# EAGLE design guest room controller V2 (EAGLE 9.6.2)
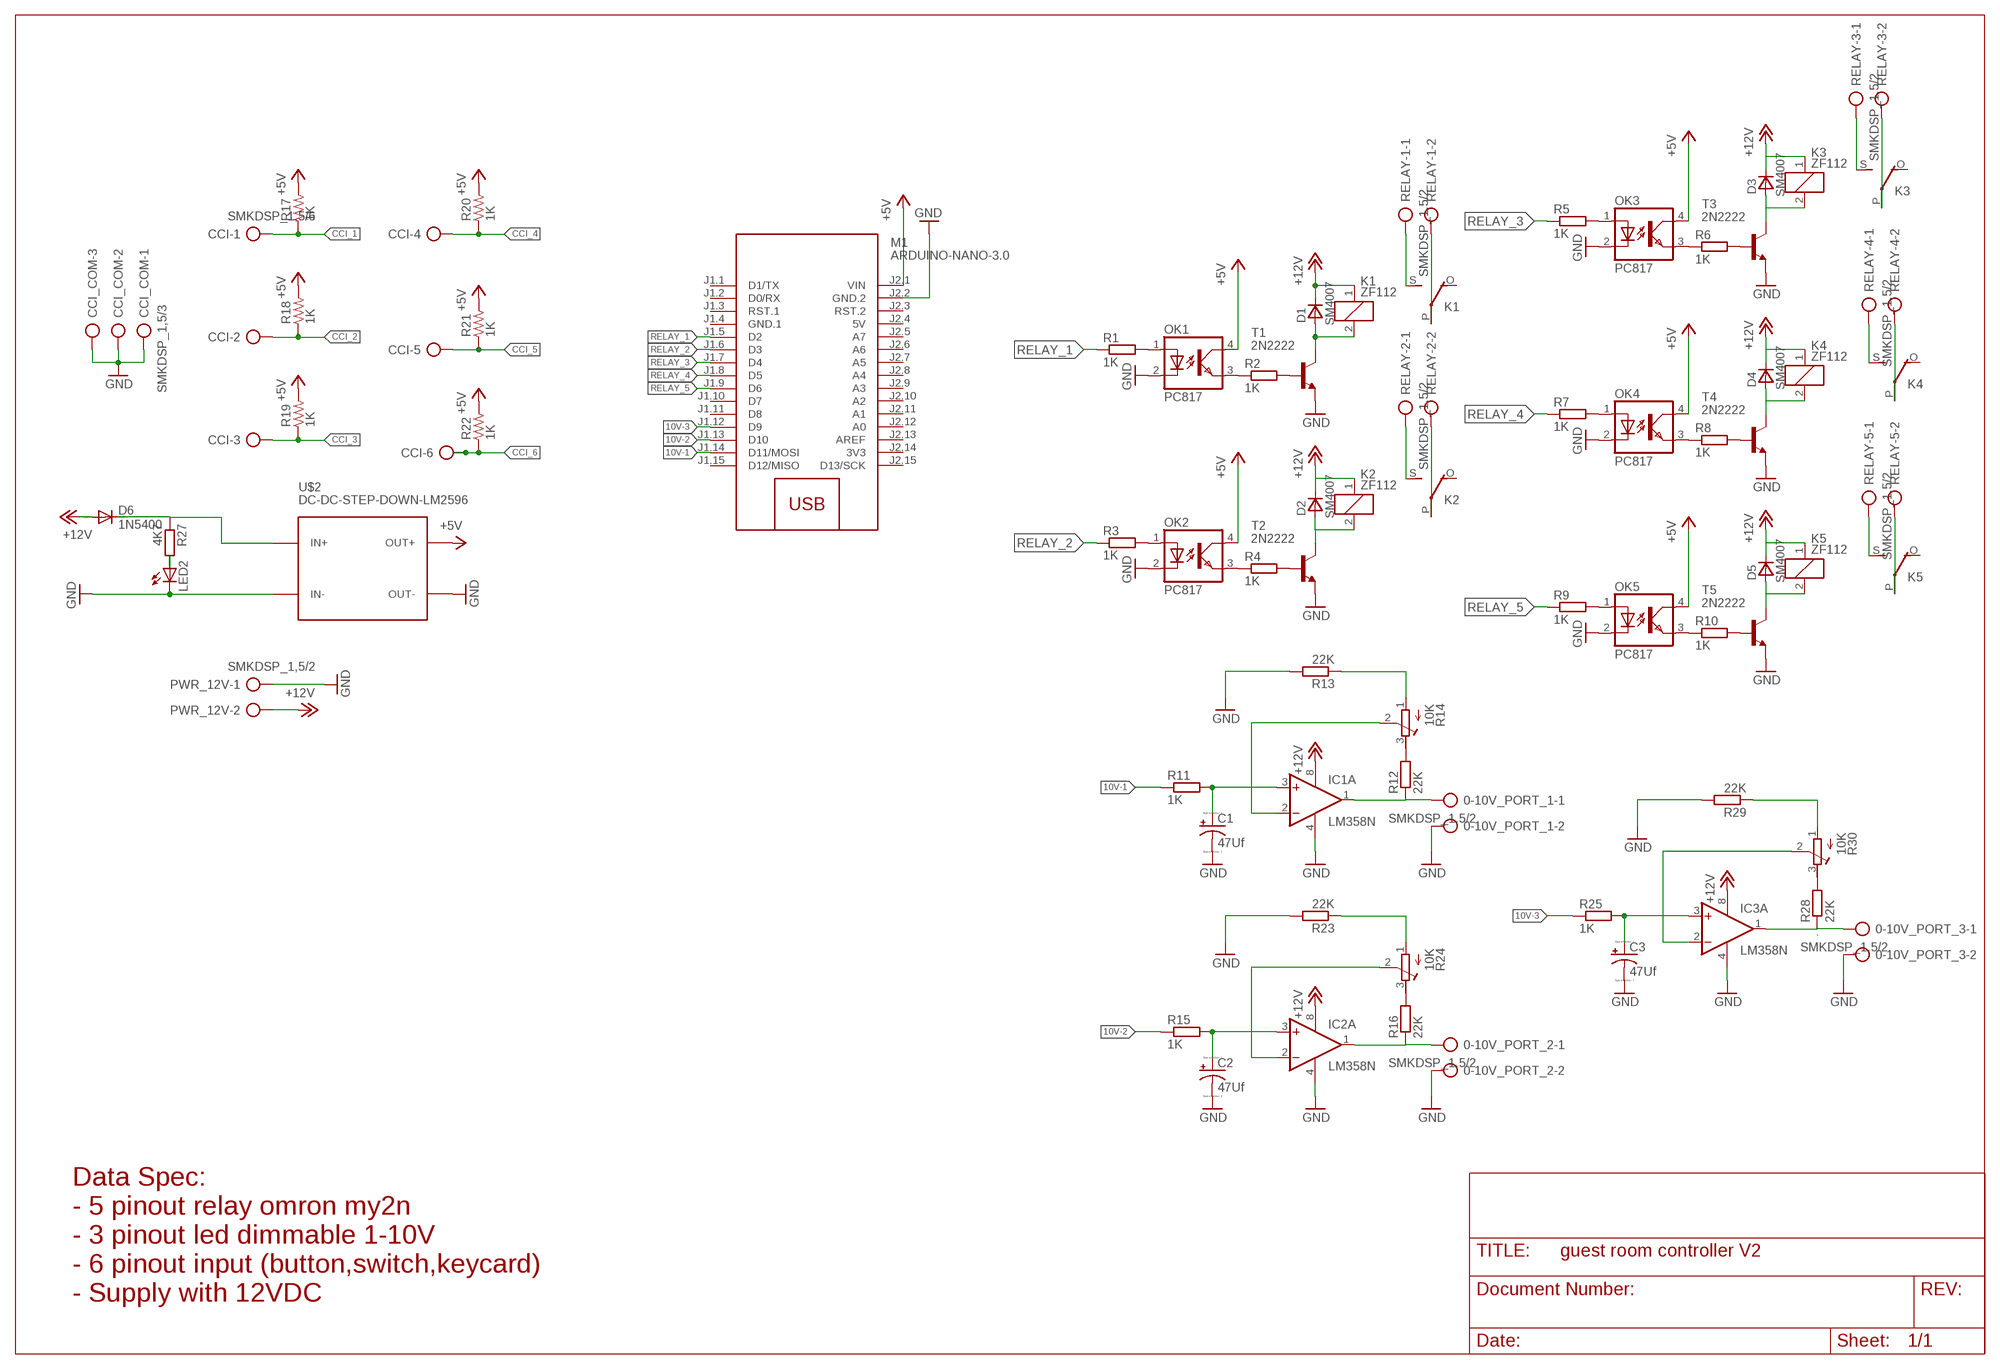
[diagram p0: schematic, sheet 1]

## Parts
0-10V_PORT_1  SMKDSP_1,5/2  [SMKDSP_1,5/2]
0-10V_PORT_2  SMKDSP_1,5/2  [SMKDSP_1,5/2]
0-10V_PORT_3  SMKDSP_1,5/2  [SMKDSP_1,5/2]
C1  47Uf  CPOL-USE2.5-6  [E2,5-6]
C2  47Uf  CPOL-USE2.5-6  [E2,5-6]
C3  47Uf  CPOL-USE2.5-6  [E2,5-6]
CCI  SMKDSP_1,5/6  [SMKDSP_1,5/6]
CCI_COM  SMKDSP_1,5/3  [SMKDSP_1,5/3]
D1  SM4007  [MELF-MLL41]
D2  SM4007  [MELF-MLL41]
D3  SM4007  [MELF-MLL41]
D4  SM4007  [MELF-MLL41]
D5  SM4007  [MELF-MLL41]
D6  1N5400  [DO201-15]
IC1  LM358N  [DIL08]
IC2  LM358N  [DIL08]
IC3  LM358N  [DIL08]
K1  ZF112  [ZF112]
K2  ZF112  [ZF112]
K3  ZF112  [ZF112]
K4  ZF112  [ZF112]
K5  ZF112  [ZF112]
LED2  LED3MM  [LED3MM]
M1  ARDUINO-NANO-3.0  [ARDUINO-NANO-3.0]
OK1  PC817  [DIL04]
OK2  PC817  [DIL04]
OK3  PC817  [DIL04]
OK4  PC817  [DIL04]
OK5  PC817  [DIL04]
PWR_12V  SMKDSP_1,5/2  [SMKDSP_1,5/2]
R1  1K  R-EU_0207/10  [0207/10]
R2  1K  R-EU_0207/10  [0207/10]
R3  1K  R-EU_0207/10  [0207/10]
R4  1K  R-EU_0207/10  [0207/10]
R5  1K  R-EU_0207/10  [0207/10]
R6  1K  R-EU_0207/10  [0207/10]
R7  1K  R-EU_0207/10  [0207/10]
R8  1K  R-EU_0207/10  [0207/10]
R9  1K  R-EU_0207/10  [0207/10]
R10  1K  R-EU_0207/10  [0207/10]
R11  1K  R-EU_0207/10  [0207/10]
R12  22K  R-EU_0207/10  [0207/10]
R13  22K  R-EU_0207/10  [0207/10]
R14  10K  R-TRIMM64P  [RTRIM64P]
R15  1K  R-EU_0207/10  [0207/10]
R16  22K  R-EU_0207/10  [0207/10]
R17  1K  R_1206  [R1206]
R18  1K  R_1206  [R1206]
R19  1K  R_1206  [R1206]
R20  1K  R_1206  [R1206]
R21  1K  R_1206  [R1206]
R22  1K  R_1206  [R1206]
R23  22K  R-EU_0207/10  [0207/10]
R24  10K  R-TRIMM64P  [RTRIM64P]
R25  1K  R-EU_0207/10  [0207/10]
R27  4K7  R-EU_0207/10  [0207/10]
R28  22K  R-EU_0207/10  [0207/10]
R29  22K  R-EU_0207/10  [0207/10]
R30  10K  R-TRIMM64P  [RTRIM64P]
RELAY-1  SMKDSP_1,5/2  [SMKDSP_1,5/2]
RELAY-2  SMKDSP_1,5/2  [SMKDSP_1,5/2]
RELAY-3  SMKDSP_1,5/2  [SMKDSP_1,5/2]
RELAY-4  SMKDSP_1,5/2  [SMKDSP_1,5/2]
RELAY-5  SMKDSP_1,5/2  [SMKDSP_1,5/2]
T1  2N2222  [TO18]
T2  2N2222  [TO18]
T3  2N2222  [TO18]
T4  2N2222  [TO18]
T5  2N2222  [TO18]
U$2  DC-DC-STEP-DOWN-LM2596  [DC-DC-STEP-DOWN-LM2596]

## Nets
10V-1: M1.J1.14(D11/MOSI) R11.1
10V-2: M1.J1.13(D10) R15.1
10V-3: M1.J1.12(D9) R25.1
+5V: M1.J2.1(VIN) OK1.4(COL) OK2.4(COL) OK3.4(COL) OK4.4(COL) OK5.4(COL) R17.2 R18.2 R19.2 R20.2 R21.2 R22.2 U$2.OUT+
+12V: D1.C D2.C D3.C D4.C D5.C D6.A IC1.8(P:V+) IC2.8(P:V+) IC3.8(P:V+) K1.1 K2.1 K3.1 K4.1 K5.1 PWR_12V.2
CCI_1: CCI.1 R17.1
CCI_2: CCI.2 R18.1
CCI_3: CCI.3 R19.1
CCI_4: CCI.4 R20.1
CCI_5: CCI.5 R21.1
CCI_6: CCI.6 R22.1
GND: 0-10V_PORT_1.2 0-10V_PORT_2.2 0-10V_PORT_3.2 C1.- C2.- C3.- CCI_COM.1 CCI_COM.2 CCI_COM.3 IC1.4(P:V-) IC2.4(P:V-) IC3.4(P:V-) LED2.K(C) M1.J2.2(GND.2) OK1.2(C) OK2.2(C) OK3.2(C) OK4.2(C) OK5.2(C) PWR_12V.1 R13.2 R23.2 R29.2 T1.1(E) T2.1(E) T3.1(E) T4.1(E) T5.1(E) U$2.IN- U$2.OUT-
N$1: OK1.3(EMIT) R2.1
N$2: R2.2 T1.2(B)
N$3: D1.A K1.2 T1.3(C)
N$4: OK2.3(EMIT) R4.1
N$5: R4.2 T2.2(B)
N$6: D2.A K2.2 T2.3(C)
N$7: OK3.3(EMIT) R6.1
N$8: R6.2 T3.2(B)
N$9: D3.A K3.2 T3.3(C)
N$10: OK4.3(EMIT) R8.1
N$11: R8.2 T4.2(B)
N$12: D4.A K4.2 T4.3(C)
N$13: OK5.3(EMIT) R10.1
N$14: R10.2 T5.2(B)
N$15: D5.A K5.2 T5.3(C)
N$16: K1.S(2:S) RELAY-1.1
N$17: LED2.A R27.2
N$18: C1.+ IC1.3(A:+IN) R11.2
N$19: 0-10V_PORT_1.1 IC1.1(A:OUT) R12.1
N$20: R12.2 R14.3(E)
N$21: IC1.2(A:-IN) R14.2(S)
N$22: R13.1 R14.1(A)
N$25: C2.+ IC2.3(A:+IN) R15.2
N$26: OK1.1(A) R1.2
N$27: OK2.1(A) R3.2
N$28: OK3.1(A) R5.2
N$29: OK4.1(A) R7.2
N$30: OK5.1(A) R9.2
N$31: 0-10V_PORT_2.1 IC2.1(A:OUT) R16.1
N$32: D6.C R27.1 U$2.IN+
N$34: K1.P(2:P) RELAY-1.2
N$35: R16.2 R24.3(E)
N$36: K2.S(2:S) RELAY-2.1
N$37: IC2.2(A:-IN) R24.2(S)
N$38: R23.1 R24.1(A)
N$40: C3.+ IC3.3(A:+IN) R25.2
N$41: 0-10V_PORT_3.1 IC3.1(A:OUT) R28.1
N$42: R28.2 R30.3(E)
N$43: IC3.2(A:-IN) R30.2(S)
N$44: R29.1 R30.1(A)
N$45: K2.P(2:P) RELAY-2.2
N$46: K3.S(2:S) RELAY-3.1
N$47: K3.P(2:P) RELAY-3.2
N$48: K4.P(2:P) RELAY-4.2
N$49: K4.S(2:S) RELAY-4.1
N$50: K5.P(2:P) RELAY-5.2
N$51: K5.S(2:S) RELAY-5.1
RELAY_1: M1.J1.5(D2) R1.1
RELAY_2: M1.J1.6(D3) R3.1
RELAY_3: M1.J1.7(D4) R5.1
RELAY_4: M1.J1.8(D5) R7.1
RELAY_5: M1.J1.9(D6) R9.1
Unconnected: IC1.5(B:+IN) IC1.6(B:-IN) IC1.7(B:OUT) IC2.5(B:+IN) IC2.6(B:-IN) IC2.7(B:OUT) IC3.5(B:+IN) IC3.6(B:-IN) IC3.7(B:OUT) K1.O(2:O) K2.O(2:O) K3.O(2:O) K4.O(2:O) K5.O(2:O) M1.J1.1(D1/TX) M1.J1.2(D0/RX) M1.J1.3(RST.1) M1.J1.10(D7) M1.J1.11(D8) M1.J1.15(D12/MISO) M1.J2.3(RST.2) M1.J2.5(A7) M1.J2.6(A6) M1.J2.7(A5) M1.J2.8(A4) M1.J2.9(A3) M1.J2.10(A2) M1.J2.11(A1) M1.J2.12(A0) M1.J2.13(AREF) M1.J2.15(D13/SCK)

## Notes on the sheet
- Data Spec:
  - 5 pinout relay omron my2n
  - 3 pinout led dimmable 1-10V
  - 6 pinout input (button,switch,keycard)
  - Supply with 12VDC

## Power pins joined to a net without a drawn wire
3V3: M1.J2.14(3V3)
5V: M1.J2.4(5V)
GND.1: M1.J1.4(GND.1)

## Library data of the parts
0-10V_PORT_1-0-10V_PORT_3 PWR_12V RELAY-1-RELAY-5 = con-phoenix-smkdsp:SMKDSP_1,5/2: Printklemme, Nennstrom: 17,5 A, Bemessungsspannung: 250 V, Raster: 5,0 mm Source: http://eshop.phoenixcontact.de .. 1733415.pdf; MF: FARNELL; MPN: 1733570; OC_FARNELL: 3041244; OC_NEWARK: 69C8588
C1-C3 = resistor:CPOL-US: POLARIZED CAPACITOR, American symbol
CCI = con-phoenix-smkdsp:SMKDSP_1,5/6: Printklemme, Nennstrom: 17,5 A, Bemessungsspannung: 250 V, Raster: 5,0 mm Source: http://eshop.phoenixcontact.de .. 1733415.pdf; MF: FARNELL; MPN: 1733619; OC_FARNELL: 3041270; OC_NEWARK: 71C4132
CCI_COM = con-phoenix-smkdsp:SMKDSP_1,5/3: Printklemme, Nennstrom: 17,5 A, Bemessungsspannung: 250 V, Raster: 5,0 mm Source: http://eshop.phoenixcontact.de .. 1733415.pdf; MF: FARNELL; MPN: 1733583; OC_FARNELL: 3041256; OC_NEWARK: 71C4130
D1-D5 = _mod_diode:SM400*: SM4001 .. SM4007 General Purpose Rectifier, 1 A SMD-Version of 1N4001 .. 1N4007 Case: MELF-MLL41 = DO 213 AB Author: Dipl.-Ing. FH Rainer Bayer HHN Hochschule Heilbronn, rainer.bayer@hs-heilbronn.de Ingenieurbüro ing-rb, mail@ing-rb.de
D6 = diode:1N5400: DIODE standard rectifier, 3 A, 50 V (Motorola)
IC1-IC3 = linear:LM358: OP AMP also LM158; LM258; LM2904 Source: http://cache.national.com/ds/LM/LM158.pdf
K1-K5 = relay:ZF112: RELAY 1 x switch; OC_FARNELL: unknown; OC_NEWARK: unknown
LED2 = led:LED: LED OSRAM: - CHIPLED LG R971, LG N971, LY N971, LG Q971, LY Q971, LO R971, LY R971 LH N974, LH R974 LS Q976, LO Q976, LY Q976 LO Q996 - Hyper CHIPLED LW Q18S LB Q993, LB Q99A, LB R99A - SideLED LS A670, LO A670, LY A670, LG A670, LP A670 LB A673, LV A673, LT A673, LW A673 LH A674 LY A675 LS A676, LA A676, LO A676, LY A676, LW A676 LS A679, LY A679, LG A679 - Hyper Micro SIDELED® LS Y876, LA Y876, LO Y876, LY Y876 LT Y87S - SmartLED LW L88C, LW L88S LB L89C, LB L89S, LG L890 LS L89K, LO L89K, LY L89K LS L896, LA L896, LO L896, LY L896 - TOPLED LS T670, LO T670, LY T670, LG T670, LP T670 LSG T670, LSP T670, LSY T670, LOP T670, LYG T670 LG T671, LOG T671, LSG T671 LB T673, LV T673, LT T673, LW T673 LH T674 LS T676, LA T676, LO T676, LY T676, LB T676, LH T676, LSB T676, LW T676 LB T67C, LV T67C, LT T67C, LS T67K, LO T67K, LY T67K, LW E67C LS E67B, LA E67B, LO E67B, LY E67B, LB E67C, LV E67C, LT E67C LW T67C LS T679, LY T679, LG T679 LS T770, LO T770, LY T770, LG T770, LP T770 LB T773, LV T773, LT T773, LW T773 LH T774 LS E675, LA E675, LY E675, LS T675 LS T776, LA T776, LO T776, LY T776, LB T776 LHGB T686 LT T68C, LB T68C - Hyper Mini TOPLED® LB M676 - Mini TOPLED Santana® LG M470 LS M47K, LO M47K, LY M47K Source: http://www.osram.convergy.de LUXEON: - LUMILED® LXK2-PW12-R00, LXK2-PW12-S00, LXK2-PW14-U00, LXK2-PW14-V00 LXK2-PM12-R00, LXK2-PM12-S00, LXK2-PM14-U00 LXK2-PE12-Q00, LXK2-PE12-R00, LXK2-PE12-S00, LXK2-PE14-T00, LXK2-PE14-U00 LXK2-PB12-K00, LXK2-PB12-L00, LXK2-PB12-M00, LXK2-PB14-N00, LXK2-PB14-P00, LXK2-PB14-Q00 LXK2-PR12-L00, LXK2-PR12-M00, LXK2-PR14-Q00, LXK2-PR14-R00 LXK2-PD12-Q00, LXK2-PD12-R00, LXK2-PD12-S00 LXK2-PH12-R00, LXK2-PH12-S00 LXK2-PL12-P00, LXK2-PL12-Q00, LXK2-PL12-R00 Source: www.luxeon.com KINGBRIGHT: KA-3528ASYC Source: www.kingbright.com
M1 = diy-modules:ARDUINO-NANO-3.0: Arduino Nano 3.0 and compatible devices More details available here: https://www.arduino.cc/en/Main/ArduinoBoardNano Click here to find device on ebay.com <http://www.ebay.com/sch/arduino+nano>
OK1-OK5 = optocoupler:PC817: SHARP OPTO COUPLER; MPN: PC817X4J000F; OC_FARNELL: 9707727; OC_NEWARK: 97K7059
R1-R13 R15 R16 R23 R25 R27-R29 = resistor:R-EU_: RESISTOR, European symbol
R14 R24 R30 = resistor:R-TRIMM: Trimm resistor
R17-R22 = rc-master-smd:R_: RESISTOR
T1-T5 = transistor:2N2222: NPN TRANSISTOR
U$2 = diy-modules:DC-DC-STEP-DOWN-LM2596: DC/DC Step-Down Regulator based on LM2596-ADJ chip LM2596 datasheet available here: http://www.ti.com/lit/ds/symlink/lm2596.pdf Click here to find device on ebay.com <http://www.ebay.com/sch/lm2596+power+regulator>

## Board
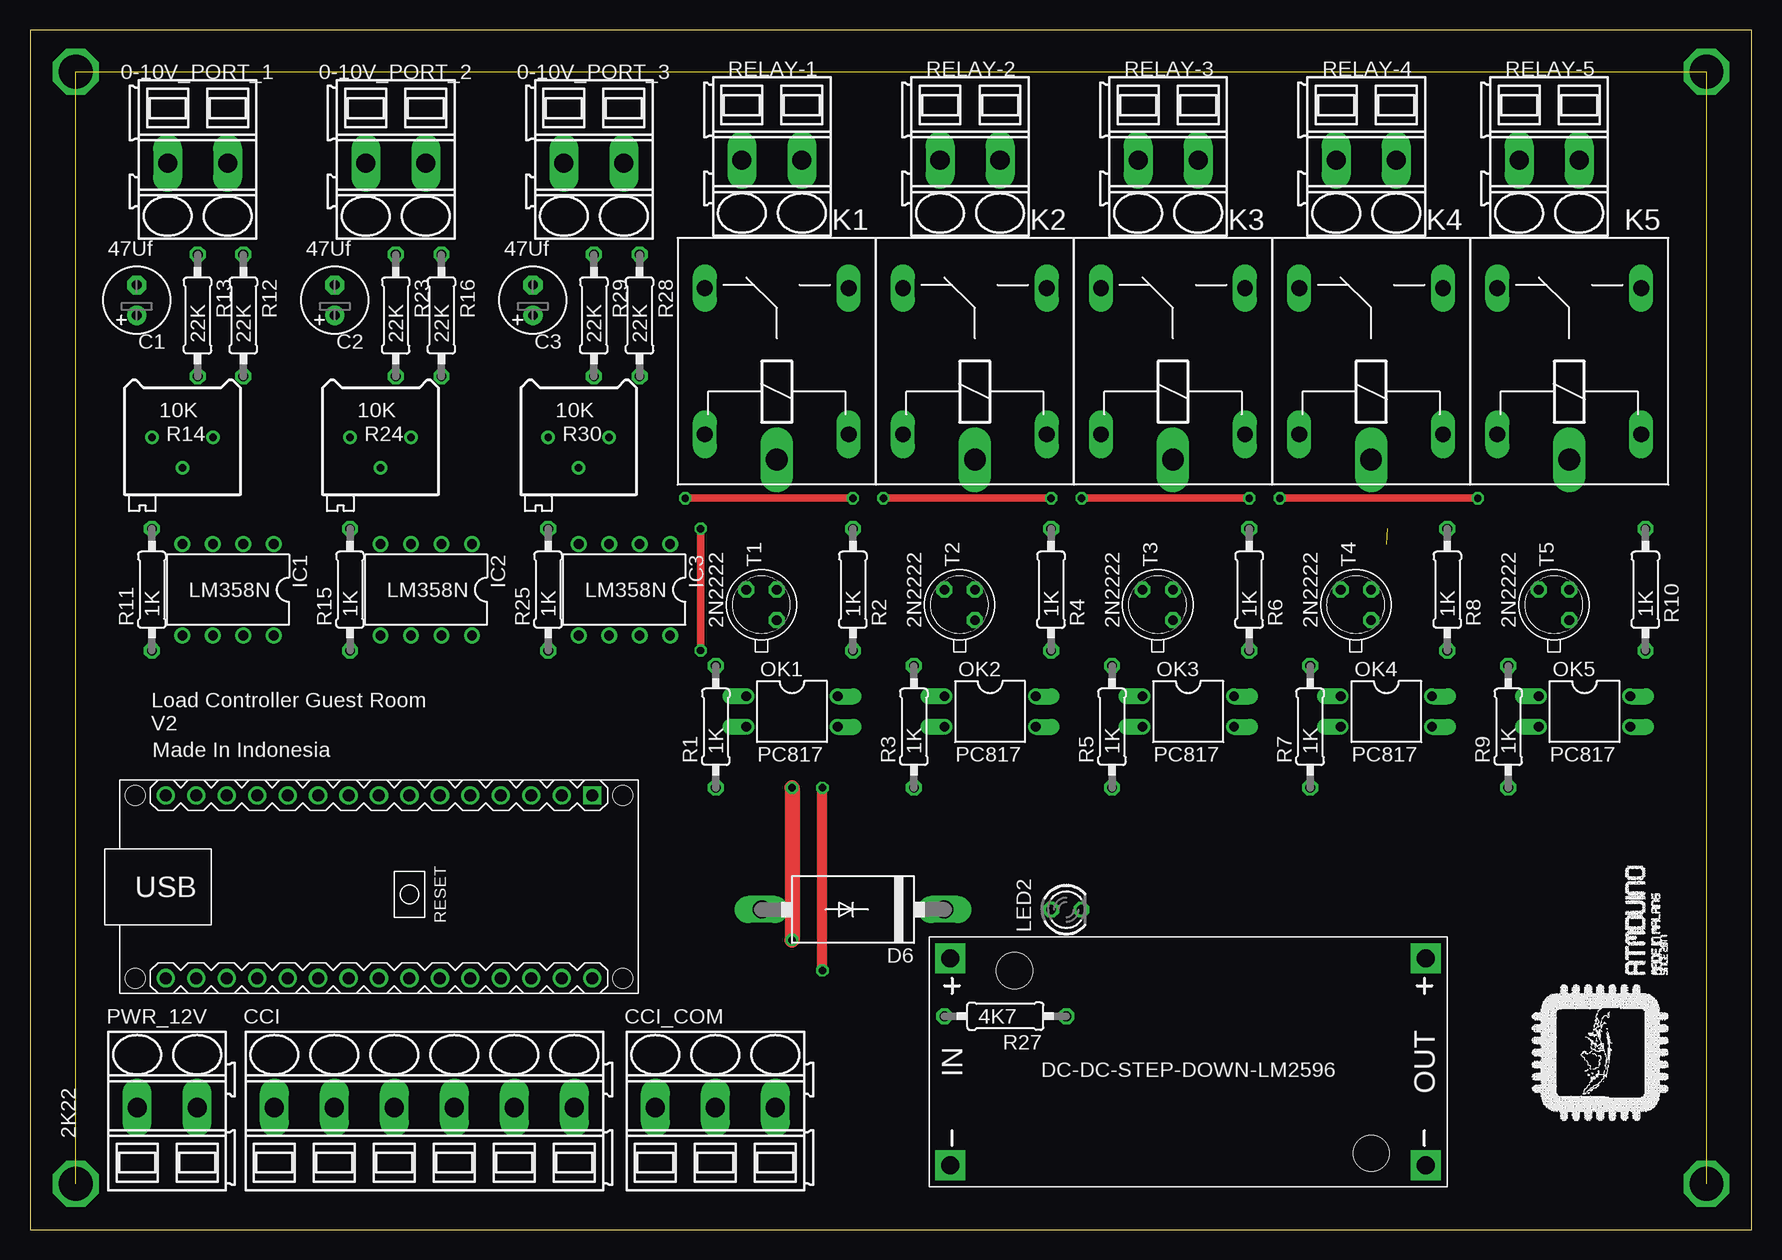
[diagram p1: board, top side]
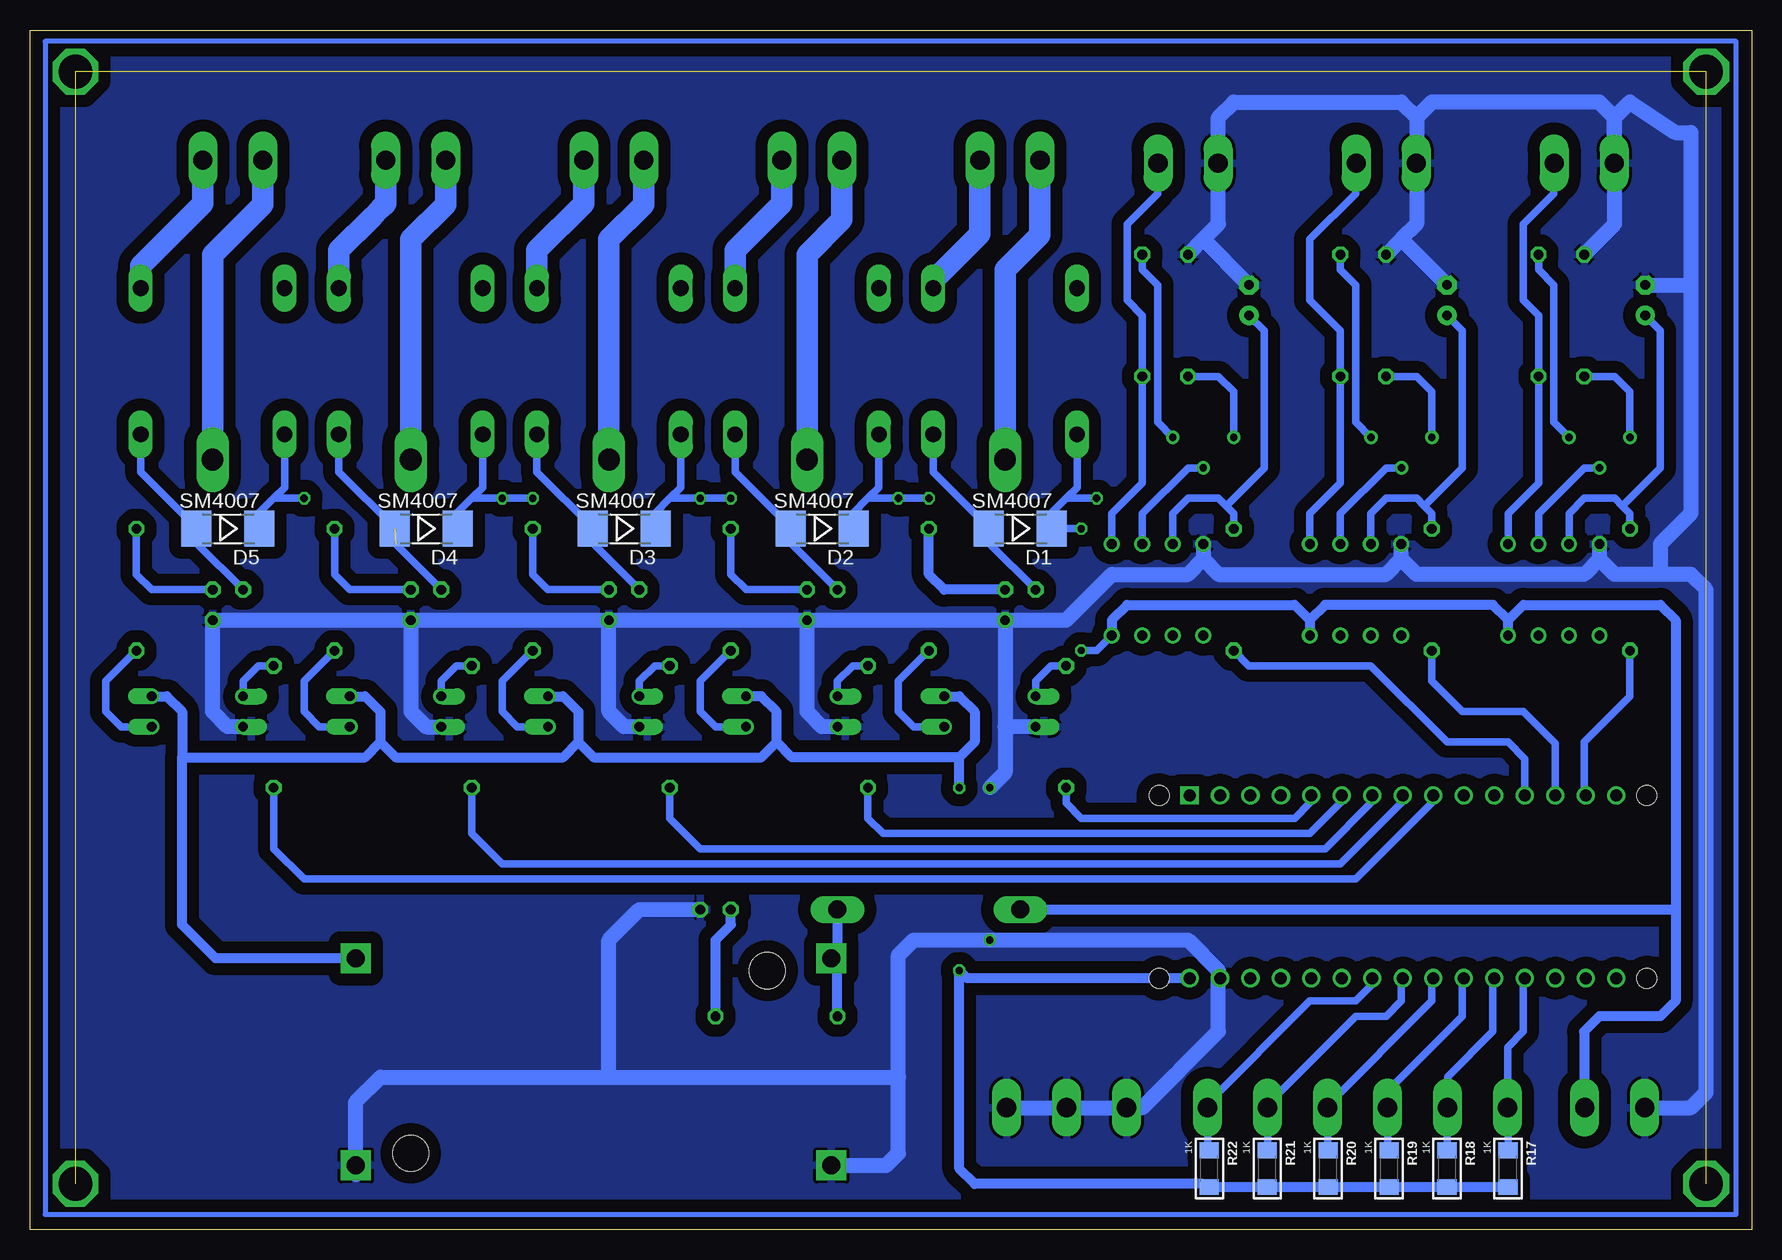
[diagram p2: board, bottom side, seen from below]

Size 143.49 x 100 mm. Coordinates in mm from the lower left corner, seen from the top.
Outline: 0,0 143.49,0 143.49,100 0,100 0,0
Copper layers (1*16): Top 0.035mm / dielectric 1.5mm / Bottom 0.035mm
Design rules "default": minimum track width 10mil, minimum drill 24mil, track to track 8mil, track to pad 8mil, pad to pad 8mil, via to via 8mil, smd to smd 8mil, copper to edge 40mil, drill to drill 8mil, minimum pad ring 10mil, minimum via ring 8mil, stop-mask expansion 4mil, vias tented up to drill 0mil, thermal gap 10mil

### Footprints (pad centres in the part's own frame; a part is rotated, then mirrored left to right if it is on the bottom)
SMKDSP_1,5/2 = drill 1.6 pad 1.8 long: 1 -2.5,0; 2 2.5,0
E2,5-6 = drill 0.813 pad 1.6: + -1.27,0 | drill 0.813 pad 1.6 octagon: - 1.27,0
SMKDSP_1,5/6 = drill 1.6 pad 1.8 long: 1 -2.5,0; 2 2.5,0; 3 7.5,0; 4 12.5,0; 5 17.5,0; 6 22.5,0
SMKDSP_1,5/3 = drill 1.6 pad 1.8 long: 1 -2.5,0; 2 2.5,0; 3 7.5,0
MELF-MLL41 = smd 2.5 x 3: A 2.625,0; C -2.625,0
DO201-15 = drill 1.499 long: A 7.62,0; C -7.62,0
DIL08 = drill 0.813 pad 1.27: 1 -3.81,-3.81; 2 -1.27,-3.81; 3 1.27,-3.81; 4 3.81,-3.81; 5 3.81,3.81; 6 1.27,3.81; 7 -1.27,3.81; 8 -3.81,3.81
ZF112 = drill 1.321 long: 1 -6.096,5.994; 2 -6.096,-5.994; O 6.096,5.994; S 6.096,-5.994 | drill 1.803 long: P -8.204,0
LED3MM = drill 0.813 octagon: A -1.27,0; K 1.27,0
ARDUINO-NANO-3.0 = drill 1 square: J1.1 17.78,7.62 | drill 1: J1.2 15.24,7.62; J1.3 12.7,7.62; J1.4 10.16,7.62; J1.5 7.62,7.62; J1.6 5.08,7.62; J1.7 2.54,7.62; J1.8 0,7.62; J1.9 -2.54,7.62; J1.10 -5.08,7.62; J1.11 -7.62,7.62; J1.12 -10.16,7.62; J1.13 -12.7,7.62; J1.14 -15.24,7.62; J1.15 -17.78,7.62; J2.1 17.78,-7.62; J2.2 15.24,-7.62; J2.3 12.7,-7.62; J2.4 10.16,-7.62; J2.5 7.62,-7.62; J2.6 5.08,-7.62; J2.7 2.54,-7.62; J2.8 0,-7.62; J2.9 -2.54,-7.62; J2.10 -5.08,-7.62; J2.11 -7.62,-7.62; J2.12 -10.16,-7.62; J2.13 -12.7,-7.62; J2.14 -15.24,-7.62; J2.15 -17.78,-7.62 | hole 1.651: -20.32,7.62; -20.32,-7.62; 20.32,-7.62; 20.32,7.62
DIL04 = drill 0.813 offset: 1 -1.27,-3.81; 2 1.27,-3.81; 3 1.27,3.81; 4 -1.27,3.81
0207/10 = drill 0.813 octagon: 1 -5.08,0; 2 5.08,0
RTRIM64P = drill 0.61: 1 0,-2.54; 2 2.54,0; 3 0,2.54
R1206 = smd 1.3 x 1.6: 1 -1.524,0; 2 1.524,0
TO18 = drill 0.813 octagon: 1 -1.27,-1.27; 2 1.27,-1.27; 3 1.27,1.27
DC-DC-STEP-DOWN-LM2596 = drill 1.5 pad 2.5 square: IN+ -19.812,8.636; IN- -19.812,-8.636; OUT+ 19.812,8.636; OUT- 19.812,-8.636 | hole 3: -14.478,7.62; 15.24,-7.62

### Placement (x,y rotation side)
0-10V_PORT_1  13.97,88.9 180 top
0-10V_PORT_2  30.48,88.9 180 top
0-10V_PORT_3  46.99,88.9 180 top
C1  8.89,77.47 90 top
C2  25.4,77.47 90 top
C3  41.91,77.47 90 top
CCI  22.86,10.16 0 top
CCI_COM  54.61,10.16 0 top
D1  60.96,58.42 180 bottom
D2  77.47,58.42 180 bottom
D3  93.98,58.42 180 bottom
D4  110.49,58.42 180 bottom
D5  127,58.42 180 bottom
D6  68.58,26.67 180 top
IC1  16.51,53.34 180 top
IC2  33.02,53.34 180 top
IC3  49.53,53.34 180 top
K1  62.23,72.39 90 top
K2  78.74,72.39 90 top
K3  95.25,72.39 90 top
K4  111.76,72.39 90 top
K5  128.27,72.39 90 top
LED2  86.36,26.67 0 top
M1  29.08,28.57 0 top
OK1  63.5,43.18 270 top
OK2  80.01,43.18 270 top
OK3  96.52,43.18 270 top
OK4  113.03,43.18 270 top
OK5  129.54,43.18 270 top
PWR_12V  11.43,10.16 0 top
R1  57.15,41.91 90 top
R2  68.58,53.34 90 top
R3  73.66,41.91 90 top
R4  85.09,53.34 90 top
R5  90.17,41.91 90 top
R6  101.6,53.34 90 top
R7  106.68,41.91 90 top
R8  118.11,53.34 90 top
R9  123.19,41.91 90 top
R10  134.62,53.34 90 top
R11  10.16,53.34 90 top
R12  17.78,76.2 90 top
R13  13.97,76.2 90 top
R14  12.7,66.04 270 top
R15  26.67,53.34 90 top
R16  34.29,76.2 90 top
R17  20.32,5.08 270 bottom
R18  25.4,5.08 270 bottom
R19  30.23,5.08 270 bottom
R20  35.31,5.08 270 bottom
R21  40.39,5.08 270 bottom
R22  45.21,5.08 270 bottom
R23  30.48,76.2 90 top
R24  29.21,66.04 270 top
R25  43.18,53.34 90 top
R27  81.28,17.78 0 top
R28  50.8,76.2 90 top
R29  46.99,76.2 90 top
R30  45.72,66.04 270 top
RELAY-1  61.82,89.15 180 top
RELAY-2  78.33,89.15 180 top
RELAY-3  94.84,89.15 180 top
RELAY-4  111.35,89.15 180 top
RELAY-5  126.59,89.15 180 top
T1  60.96,52.07 90 top
T2  77.47,52.07 90 top
T3  93.98,52.07 90 top
T4  110.49,52.07 90 top
T5  127,52.07 90 top
U$2  96.52,13.97 0 top

### Tracks (layer width: path | path; a pad name or v marks a point on that pad's centre or on a via)
10V-1
  Bottom 0.61: R11.1 10.16,44.45 13.97,40.64 13.97,36.32 M1.J1.14
10V-2
  Bottom 0.61: M1.J1.13 16.38,40.51 19.05,43.18 24.13,43.18 26.67,45.72 R15.1
10V-3
  Bottom 0.61: M1.J1.12 18.92,39.24 20.32,40.64 25.4,40.64 31.75,46.99 41.91,46.99 R25.1
+5V  (via drill 0.6)
  Top 0.813: v66.04,21.59 v66.04,36.83
  Bottom 0.61: R19.2 30.48,3.81 | R22.2 45.47,3.56 45.72,3.81
  Bottom 0.813: R22.2 R21.2 R20.2 R19.2 R18.2 R17.2 | OK1.4 66.04,44.45 64.77,43.18 64.77,40.64 66.04,39.37 | 66.04,39.37 80.01,39.37 81.28,40.64 | 81.28,40.64 81.28,43.18 82.55,44.45 OK2.4 | OK3.4 99.06,44.45 97.79,43.18 97.79,40.64 | 97.79,40.64 96.52,39.37 82.55,39.37 81.28,40.64 | OK4.4 115.57,44.45 114.3,43.18 114.3,40.64 | 114.3,40.64 113.03,39.37 99.06,39.37 97.79,40.64 | OK5.4 132.08,44.45 130.81,43.18 130.81,39.37 | 130.81,39.37 115.57,39.37 114.3,40.64 | U$2.OUT+ 128.02,22.61 130.81,25.4 130.81,39.37 | M1.J2.1 65.41,20.96 v66.04,21.59 66.04,5.08 64.77,3.81 45.72,3.81 | v66.04,36.83 66.04,39.37
+12V  (via drill 0.6)
  Top 0.61: v120.65,60.96 v104.14,60.96 | v101.6,60.96 v87.63,60.96 | v85.09,60.96 v71.12,60.96 | v68.58,60.96 v54.61,60.96 | v55.88,58.42 v55.88,48.26
  Bottom 0.61: K1.1 56.24,61.87 57.15,60.96 | 57.15,60.96 58.42,59.69 | 58.42,59.69 58.42,58.51 | 58.42,58.51 D1.C 58.33,59.6 58.42,59.69 | K4.1 105.77,61.87 106.68,60.96 | 106.68,60.96 107.95,59.69 107.95,58.51 D4.C | K2.1 72.75,61.87 73.66,60.96 | 73.66,60.96 74.93,59.69 74.93,58.51 D2.C | K5.1 122.28,61.87 123.19,60.96 | 124.37,59.77 124.46,59.69 124.46,58.42 D5.C 124.37,59.77 | K3.1 89.26,61.87 90.17,60.96 | 90.17,60.96 91.44,59.69 91.44,58.51 D3.C | 124.37,59.77 123.19,60.96 | 123.19,60.96 v120.65,60.96 | 106.68,60.96 v104.14,60.96 v101.6,60.96 | 90.17,60.96 v87.63,60.96 v85.09,60.96 | 73.66,60.96 v71.12,60.96 v68.58,60.96 | v54.61,60.96 57.15,60.96 | 58.42,58.51 58.42,58.42 v55.88,58.42 | v55.88,48.26 54.61,48.26 IC3.8
  Bottom 0.813: 20.32,50.8 21.59,52.07 35.56,52.07 36.83,50.8 | 36.83,50.8 IC2.8 | IC3.8 53.34,50.8 52.07,52.07 38.1,52.07 36.83,50.8 | PWR_12V.2 13.97,10.2 13.97,16.51 12.7,17.78 7.62,17.78 6.35,19.05 6.35,26.67 | IC1.8 20.32,50.8 | 20.32,50.8 19.05,52.07 7.62,52.07 6.35,50.8 6.35,26.67 | D6.A 6.35,26.67
CCI_1
  Bottom 0.61: R17.1 20.32,10.12 CCI.1 20.36,15.2 19.05,16.51 19.05,20.83
CCI_2
  Bottom 0.61: 21.59,20.83 21.59,16.51 25.36,12.74 CCI.2 25.4,10.12 R18.1
CCI_3
  Bottom 0.61: R19.1 30.36,6.74 CCI.3 30.36,11.55 24.13,17.78 24.13,20.83
CCI_4
  Bottom 0.61: R20.1 35.36,6.66 CCI.4 35.36,10.36 26.67,19.05 26.67,20.83
CCI_5
  Bottom 0.61: R21.1 40.36,6.63 CCI.5 40.36,10.44 33.02,17.78 30.48,17.78 29.21,19.05 29.21,20.83
CCI_6
  Bottom 0.61: R22.1 45.36,6.75 CCI.6 45.36,10.52 36.83,19.05 33.02,19.05 31.75,20.32 31.75,20.83
GND  (via drill 0.6)
  Top 1.27: v63.5,36.83 v63.5,24.13
  Bottom 1.27: T4.1 T5.1 128.27,43.18 127,41.91 OK5.2 | T4.1 T3.1 | T3.1 T2.1 | T2.1 T1.1 | OK3.2 93.98,41.91 95.25,43.18 T3.1 | OK2.2 77.47,41.91 78.74,43.18 T2.1 | CCI_COM.3 CCI_COM.1 | CCI_COM.1 52.07,10.16 | CCI_COM.1 50.8,10.16 44.45,16.51 44.45,20.83 M1.J2.2 44.45,21.08 44.45,21.59 46.99,24.13 v63.5,24.13 69.85,24.13 71.12,22.86 71.12,12.7 | T4.1 111.76,43.18 110.49,41.91 OK4.2 | v63.5,36.83 62.23,38.1 62.23,41.91 | 116.33,4.57 U$2.OUT- 116.33,10.67 114.3,12.7 95.25,12.7 | U$2.IN- 72.14,5.33 71.12,6.35 71.12,12.7 | 95.25,12.7 71.12,12.7 | 95.25,12.7 95.25,24.13 92.71,26.67 LED2.K | T1.1 62.23,41.91 | OK1.2 62.23,41.91 | 44.45,88.86 44.45,83.82 45.72,82.55 | 44.45,88.86 0-10V_PORT_3.2 | 27.94,92.71 26.67,93.98 12.7,93.98 11.47,92.75 0-10V_PORT_1.2 11.43,88.86 | 27.94,92.71 27.94,88.94 0-10V_PORT_2.2 27.94,88.86 27.94,83.82 29.21,82.55 | 44.45,88.86 44.45,92.71 43.18,93.98 29.21,93.98 27.94,92.71 | T1.1 57.15,50.8 53.34,54.61 46.99,54.61 45.72,55.88 | IC3.4 45.72,55.88 | 45.72,55.88 44.45,54.61 30.48,54.61 29.21,55.88 | 29.21,55.88 IC2.4 | IC1.4 12.7,55.88 | 12.7,55.88 13.97,54.61 27.94,54.61 29.21,55.88 | 5.08,78.74 5.08,59.69 7.62,57.15 7.62,54.61 | 7.62,54.61 11.43,54.61 12.7,55.88 | PWR_12V.1 5.08,10.16 3.81,11.43 3.81,53.34 5.08,54.61 7.62,54.61 | 11.43,88.86 11.43,92.71 10.16,93.98 6.35,91.44 5.08,91.44 5.08,78.74 | C1.- 5.08,78.74 | R13.2 11.43,83.82 11.43,88.86 | 29.21,82.55 R23.2 | R29.2 45.72,82.55 | C3.- 45.72,82.55 | C2.- 29.21,82.55
  pour Bottom (isolate 1.016): 2.54,97.79 140.97,97.79 140.97,2.54 2.54,2.54
N$1
  Bottom 0.61: R2.1 71.12,45.72 71.12,43.18 69.85,41.91 OK1.3
N$2
  Bottom 0.813: T1.2 67.31,53.34 68.58,54.61 R2.2
N$3
  Bottom 0.61: T1.3 63.58,57.24 D1.A 63.58,58.51 68.22,63.14 K1.2
N$4
  Bottom 0.61: R4.1 87.63,45.72 87.63,43.18 86.36,41.91 OK2.3
N$5
  Bottom 0.61: T2.2 83.82,53.34 85.09,54.61 R4.2
N$6
  Bottom 0.61: T2.3 80.01,57.15 80.01,58.34 D2.A 80.09,58.51 84.73,63.14 K2.2
N$7
  Bottom 0.61: R6.1 104.14,45.72 104.14,43.18 102.87,41.91 OK3.3
N$8
  Bottom 0.61: T3.2 100.33,53.34 101.6,54.61 R6.2
N$9
  Bottom 0.61: T3.3 96.52,57.15 96.52,58.42 D3.A 96.61,58.51 101.24,63.14 K3.2
N$10
  Bottom 0.61: R8.1 120.65,45.72 120.65,43.18 119.38,41.91 OK4.3
N$11
  Bottom 0.61: T4.2 116.84,53.34 118.11,54.61 R8.2
N$12  (1 unrouted)
  Bottom 0.61: T4.3 113.03,57.15 | D4.A 113.11,58.51 117.75,63.14 K4.2
N$13
  Bottom 0.61: R10.1 137.16,45.72 137.16,43.18 135.89,41.91 OK5.3
N$14
  Bottom 0.61: T5.2 133.35,53.34 134.62,54.61 R10.2
N$15
  Bottom 0.61: T5.3 129.54,57.15 129.54,58.34 D5.A 129.62,58.51 134.26,63.14 K5.2
N$16
  Bottom 1.778: K1.S 68.22,79.1 64.32,83 RELAY-1.1
N$17
  Bottom 0.813: R27.2 86.36,24.13 85.09,25.4 LED2.A
N$18
  Bottom 0.61: R11.2 10.16,59.69 10.8,60.32 | 10.8,60.32 11.43,60.96 13.97,60.96 15.24,59.69 IC1.3 | 10.8,60.32 7.62,63.5 7.62,74.93 C1.+
N$19
  Bottom 0.61: IC1.1 20.32,59.69 17.78,62.23 R12.1 17.78,76.2 19.05,77.47 19.05,83.82 16.51,86.36 16.51,88.86 0-10V_PORT_1.1
N$20
  Bottom 0.61: R14.3 16.51,67.31 16.51,78.74 17.78,80.01 R12.2
N$21
  Bottom 0.61: IC1.2 17.78,59.69 13.97,63.5 R14.2
N$22
  Bottom 0.61: R14.1 10.16,69.85 11.43,71.12 R13.1
N$25
  Bottom 0.61: R15.2 26.67,59.69 27.3,60.32 | 27.3,60.32 27.94,60.96 30.48,60.96 31.75,59.69 IC2.3 | 27.3,60.32 24.13,63.5 24.13,74.93 C2.+
N$26
  Bottom 0.61: R1.2 58.42,46.99 59.69,45.72 OK1.1
N$27
  Bottom 0.61: R3.2 74.93,46.99 76.2,45.72 OK2.1
N$28
  Bottom 0.61: R5.2 91.44,46.99 92.71,45.72 OK3.1
N$29
  Bottom 0.61: R7.2 107.95,46.99 109.22,45.72 OK4.1
N$30
  Bottom 0.61: R9.2 124.46,46.99 125.73,45.72 OK5.1
N$31
  Bottom 0.61: IC2.1 36.83,59.69 34.29,62.23 R16.1 34.29,74.93 36.83,77.47 36.83,82.55 33.02,86.36 33.02,88.86 0-10V_PORT_2.1
N$32
  Bottom 0.813: R27.1 76.2,22.1 U$2.IN+ 76.2,23.11 D6.C
N$33  (via drill 2.8)  (3 unrouted)
  other vias: 139.7,3.81 3.81,3.81 3.81,96.52 139.7,96.52
N$34
  Bottom 1.778: K1.P 62.23,80.01 59.32,82.92 RELAY-1.2
N$35
  Bottom 0.61: R24.3 33.02,67.31 33.02,78.74 34.29,80.01 R16.2
N$36
  Bottom 1.778: K2.S 84.73,81.64 80.83,85.54 RELAY-2.1
N$37
  Bottom 0.61: IC2.2 34.29,59.69 30.48,63.5 R24.2
N$38
  Bottom 0.61: R24.1 26.67,69.85 27.94,71.12 R23.1
N$40
  Bottom 0.61: R25.2 43.18,59.69 43.81,60.32 | 43.81,60.32 44.45,60.96 46.99,60.96 48.26,59.69 IC3.3 | 43.81,60.32 40.64,63.5 40.64,74.93 C3.+
N$41
  Bottom 0.61: IC3.1 53.34,59.69 50.8,62.23 R28.1 50.8,76.2 52.07,77.47 52.07,83.82 49.53,86.36 49.53,88.86 0-10V_PORT_3.1
N$42
  Bottom 0.61: R30.3 49.53,67.31 49.53,78.74 50.8,80.01 R28.2
N$43
  Bottom 0.61: IC3.2 50.8,59.69 46.99,63.5 R30.2
N$44
  Bottom 0.61: R30.1 43.18,69.85 44.45,71.12 R29.1
N$45
  Bottom 1.778: K2.P 78.74,81.28 75.83,84.19 RELAY-2.2
N$46
  Bottom 1.778: K3.S 101.24,81.64 97.34,85.54 RELAY-3.1
N$47
  Bottom 1.778: K3.P 95.25,82.55 92.34,85.46 RELAY-3.2
N$48
  Bottom 1.778: K4.P 111.76,82.55 108.85,85.46 RELAY-4.2
N$49
  Bottom 1.778: K4.S 117.75,81.64 114.93,84.46 114.3,85.09 113.85,85.54 RELAY-4.1
N$50
  Bottom 1.778: K5.P 128.27,81.28 124.09,85.46 RELAY-5.2
N$51
  Bottom 1.778: K5.S 134.26,80.37 129.09,85.54 RELAY-5.1
N$55
  Bottom 0.406: 1.32,99.06 142.24,99.06 142.24,1.27 1.32,1.27 1.32,99.06
RELAY_1
  Bottom 0.61: M1.J1.5 36.83,36.07 36.83,35.56 38.1,34.29 55.88,34.29 57.15,35.56 R1.1
RELAY_2
  Bottom 0.61: R3.1 73.66,34.29 72.39,33.02 36.83,33.02 34.29,35.56 34.29,36.07 M1.J1.6
RELAY_3
  Bottom 0.61: R5.1 90.17,34.29 87.63,31.75 35.56,31.75 31.75,35.56 31.75,36.07 M1.J1.7
RELAY_4
  Bottom 0.61: M1.J1.8 29.21,36.07 29.21,35.56 34.29,30.48 104.14,30.48 106.68,33.02 R7.1
RELAY_5
  Bottom 0.61: M1.J1.9 26.54,35.69 33.02,29.21 120.65,29.21 123.19,31.75 R9.1

### Text on the board
tNames: Load Controller Guest Room / V2 | Made In Indonesia | 2K22